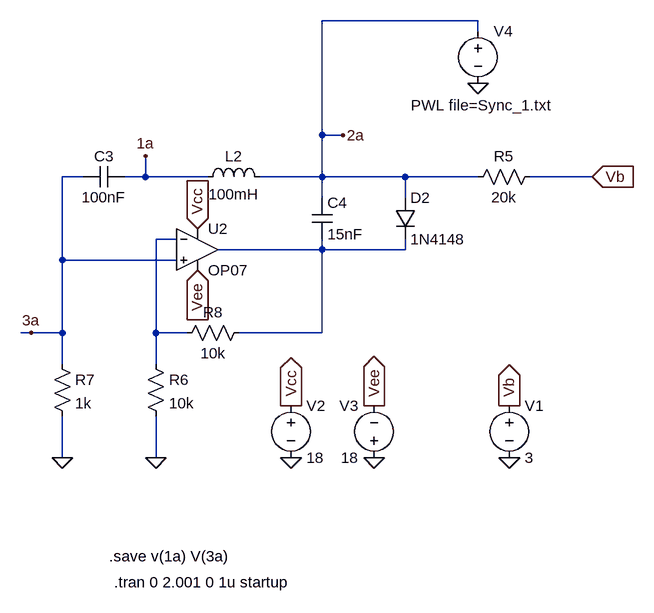
[diagram p0: schematic V_RX.asc]
V_RX.asc, the LTspice schematic file:
Version 4
SHEET 1 1596 1032
WIRE 896 -464 656 -464
WIRE 896 -448 896 -464
WIRE 656 -288 656 -464
WIRE 688 -288 656 -288
WIRE 288 -224 256 -224
WIRE 384 -224 384 -256
WIRE 384 -224 352 -224
WIRE 480 -224 384 -224
WIRE 656 -224 656 -288
WIRE 656 -224 560 -224
WIRE 784 -224 656 -224
WIRE 896 -224 784 -224
WIRE 1072 -224 976 -224
WIRE 656 -192 656 -224
WIRE 784 -192 784 -224
WIRE 432 -128 400 -128
WIRE 656 -112 656 -128
WIRE 656 -112 496 -112
WIRE 784 -112 784 -128
WIRE 784 -112 656 -112
WIRE 256 -96 256 -224
WIRE 432 -96 256 -96
WIRE 208 16 192 16
WIRE 256 16 256 -96
WIRE 256 16 208 16
WIRE 400 16 400 -128
WIRE 448 16 400 16
WIRE 656 16 656 -112
WIRE 656 16 528 16
WIRE 256 64 256 16
WIRE 400 64 400 16
WIRE 256 208 256 144
WIRE 400 208 400 144
FLAG 944 208 0
FLAG 944 128 Vb
IOPIN 944 128 Out
FLAG 608 208 0
FLAG 736 208 0
FLAG 608 128 Vcc
IOPIN 608 128 Out
FLAG 736 128 Vee
IOPIN 736 128 Out
FLAG 256 208 0
FLAG 400 208 0
FLAG 1072 -224 Vb
IOPIN 1072 -224 In
FLAG 464 -144 Vcc
IOPIN 464 -144 In
FLAG 464 -80 Vee
IOPIN 464 -80 In
FLAG 384 -256 1a
FLAG 688 -288 2a
FLAG 208 16 3a
FLAG 896 -368 0
SYMBOL voltage 944 112 R0
WINDOW 123 0 0 Left 0
WINDOW 39 0 0 Left 0
SYMATTR InstName V1
SYMATTR Value 3
SYMBOL voltage 608 112 R0
WINDOW 123 0 0 Left 0
WINDOW 39 0 0 Left 0
SYMATTR InstName V2
SYMATTR Value 18
SYMBOL voltage 736 224 R180
WINDOW 0 24 96 Left 2
WINDOW 3 24 16 Left 2
WINDOW 123 0 0 Left 0
WINDOW 39 0 0 Left 0
SYMATTR InstName V3
SYMATTR Value 18
SYMBOL cap 288 -208 R270
WINDOW 0 32 32 VTop 2
WINDOW 3 0 32 VBottom 2
SYMATTR InstName C3
SYMATTR Value 100nF
SYMBOL ind 464 -208 R270
WINDOW 0 32 56 VTop 2
WINDOW 3 5 56 VBottom 2
SYMATTR InstName L2
SYMATTR Value 100mH
SYMBOL res 992 -240 R90
WINDOW 0 0 56 VBottom 2
WINDOW 3 32 56 VTop 2
SYMATTR InstName R5
SYMATTR Value 20k
SYMBOL cap 640 -192 R0
SYMATTR InstName C4
SYMATTR Value 15nF
SYMBOL diode 768 -192 R0
SYMATTR InstName D2
SYMATTR Value 1N4148
SYMBOL res 384 48 R0
SYMATTR InstName R6
SYMATTR Value 10k
SYMBOL res 240 48 R0
SYMATTR InstName R7
SYMATTR Value 1k
SYMBOL res 544 0 R90
WINDOW 0 0 56 VBottom 2
WINDOW 3 32 56 VTop 2
SYMATTR InstName R8
SYMATTR Value 10k
SYMBOL Opamps\\OP07 464 -176 R0
SYMATTR InstName U2
SYMBOL voltage 896 -464 R0
WINDOW 3 -103 130 Left 2
WINDOW 123 0 0 Left 0
WINDOW 39 0 0 Left 0
SYMATTR Value PWL file=Sync_1.txt
SYMATTR InstName V4
TEXT 336 400 Left 2 !.tran 0 2.001 0 1u startup
TEXT 328 360 Left 2 !.save v(1a) V(3a)

The netlist it stands for:
* V_RX.asc
V1 Vb 0 3
V2 Vcc 0 18
V3 0 Vee 18
C3 3a 1a 100nF
L2 1a 2a 100mH
R5 Vb 2a 20k
C4 2a N002 15nF
D2 2a N002 1N4148
R6 N001 0 10k
R7 3a 0 1k
R8 N002 N001 10k
XU2 3a N001 Vcc Vee N002 LT1001  ; OP07, pins In+ In- V+ V- OUT
V4 2a 0 PWL file=Sync_1.txt
.model D D
.lib standard.dio
.tran 0 2.001 0 1u startup
.save v(1a) V(3a)
.lib LTC.lib
.backanno
.end